# EAGLE schematic blinkm_mk2a (EAGLE 6.4)
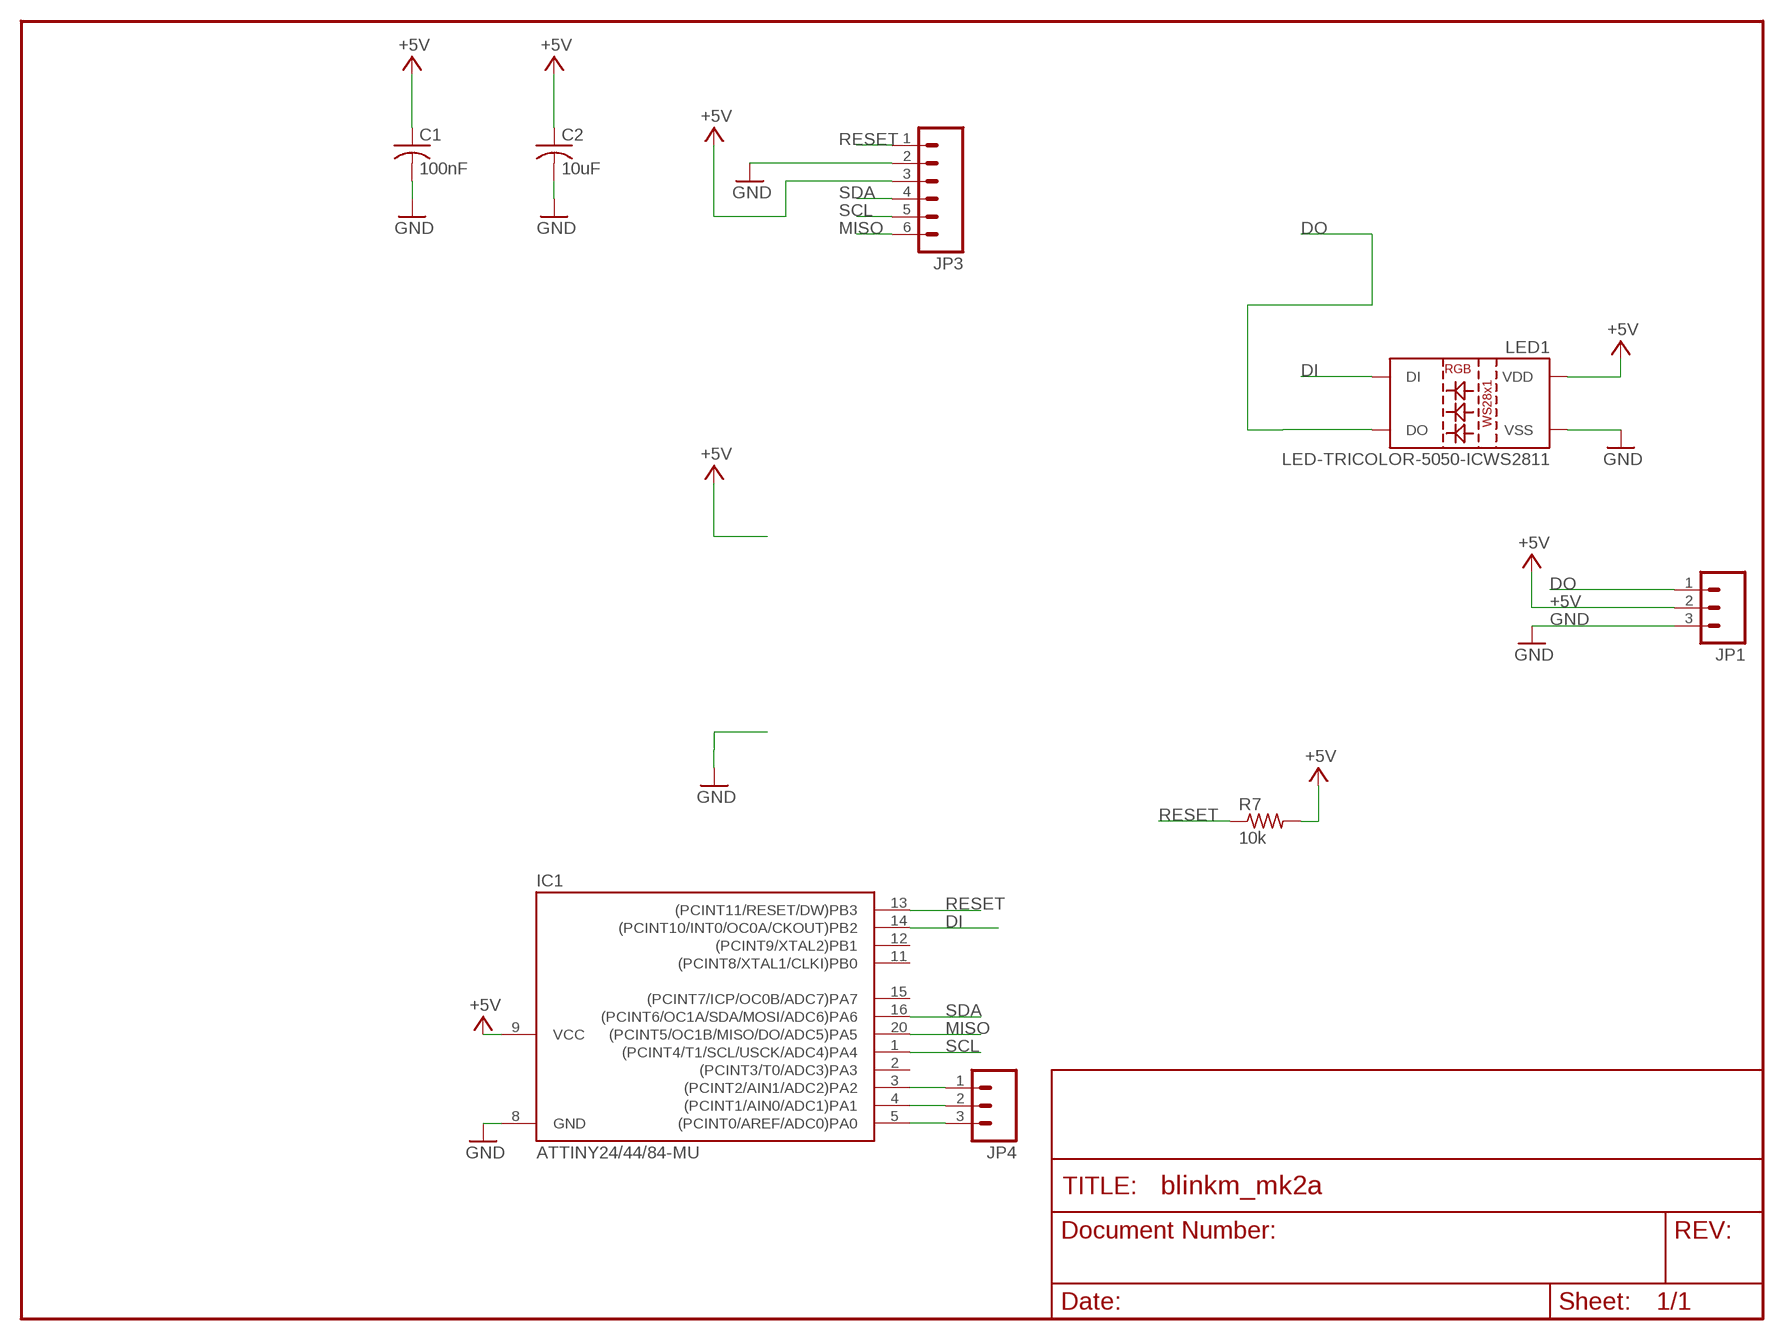
[diagram p0: schematic, sheet 1]

## Parts
C1  100nF  C-USC0603  [C0603]
C2  10uF  C-USC0603  [C0603]
IC1  ATTINY24/44/84-MU  [QFN/MLF20]
JP1  M03PTH  [1X03]
JP3  M06SIP  [1X06]
JP4  M03PTH  [1X03]
LED1  LED-TRICOLOR-5050-ICWS2811  [LED-TRICOLOR-5050-IC]
R7  10k  R-US_R0603  [R0603]

## Nets
+5V: C1.1 C2.1 IC1.9(VCC) JP1.2 JP3.3 LED1.3(VDD) LED1.5(VDD) R7.2
DI: IC1.14((PCINT10/INT0/OC0A/CKOUT)PB2) LED1.2(DI)
DO: JP1.1 LED1.1(DO)
GND: C1.2 C2.2 IC1.8(GND) JP1.3 JP3.2 LED1.6(VSS)
MISO: IC1.20((PCINT5/OC1B/MISO/DO/ADC5)PA5) JP3.6
N$1: IC1.3((PCINT2/AIN1/ADC2)PA2) JP4.1
N$2: IC1.4((PCINT1/AIN0/ADC1)PA1) JP4.2
N$3: IC1.5((PCINT0/AREF/ADC0)PA0) JP4.3
RESET: IC1.13((PCINT11/RESET/DW)PB3) JP3.1 R7.1
SCL: IC1.1((PCINT4/T1/SCL/USCK/ADC4)PA4) JP3.5
SDA: IC1.16((PCINT6/OC1A/SDA/MOSI/ADC6)PA6) JP3.4
Unconnected: IC1.2((PCINT3/T0/ADC3)PA3) IC1.11((PCINT8/XTAL1/CLKI)PB0) IC1.12((PCINT9/XTAL2)PB1) IC1.15((PCINT7/ICP/OC0B/ADC7)PA7)

## Library data of the parts
C1 C2 = rcl:C-US: CAPACITOR, American symbol
IC1 = attiny24_44_84:ATTINY24/44/84
JP1 JP4 = SparkFun-20110517:M03: Header 3 Standard 3-pin 0.1" header. Use with straight break away headers (SKU : PRT-00116), right angle break away headers (PRT-00553), swiss pins (PRT-00743), machine pins (PRT-00117), and female headers (PRT-00115). Molex polarized connector foot print use with SKU : PRT-08232 with associated crimp pins and housings.
JP3 = SparkFun-Connectors:M06: Header 6 Standard 6-pin 0.1" header. Use with straight break away headers (SKU : PRT-00116), right angle break away headers (PRT-00553), swiss pins (PRT-00743), machine pins (PRT-00117), and female headers (PRT-00115). Molex polarized connector foot print use with SKU : PRT-08094 with associated crimp pins and housings. NOTES ON THE VARIANTS LOCK and LOCK_LONGPADS... This footprint was designed to help hold the alignment of a through-hole component (i.e. 6-pin header) while soldering it into place. You may notice that each hole has been shifted either up or down by 0.005 of an inch from it's more standard position (which is a perfectly straight line). This slight alteration caused the pins (the squares in the middle) to touch the edges of the holes. Because they are alternating, it causes a "brace" to hold the component in place. 0.005 has proven to be the perfect amount of "off-center" position when using our standard breakaway headers. Although looks a little odd when you look at the bare footprint, once you have a header in there, the alteration is very hard to notice. Also, if you push a header all the way into place, it is covered up entirely on the bottom side. This idea of altering the position of holes to aid alignment will be further integrated into the Sparkfun Library for other footprints. It can help hold any component with 3 or more connection pins.
LED1 = SparkFun-LED:LED-TRICOLOR-5050-IC: 5x5mm SMD LED with built-in controller IC.
R7 = rcl:R-US_: RESISTOR, American symbol